# Altium schematic sheet I2C_Multiplexer.SchDoc
size A4; SheetNumber: 14; SheetTotal: 15
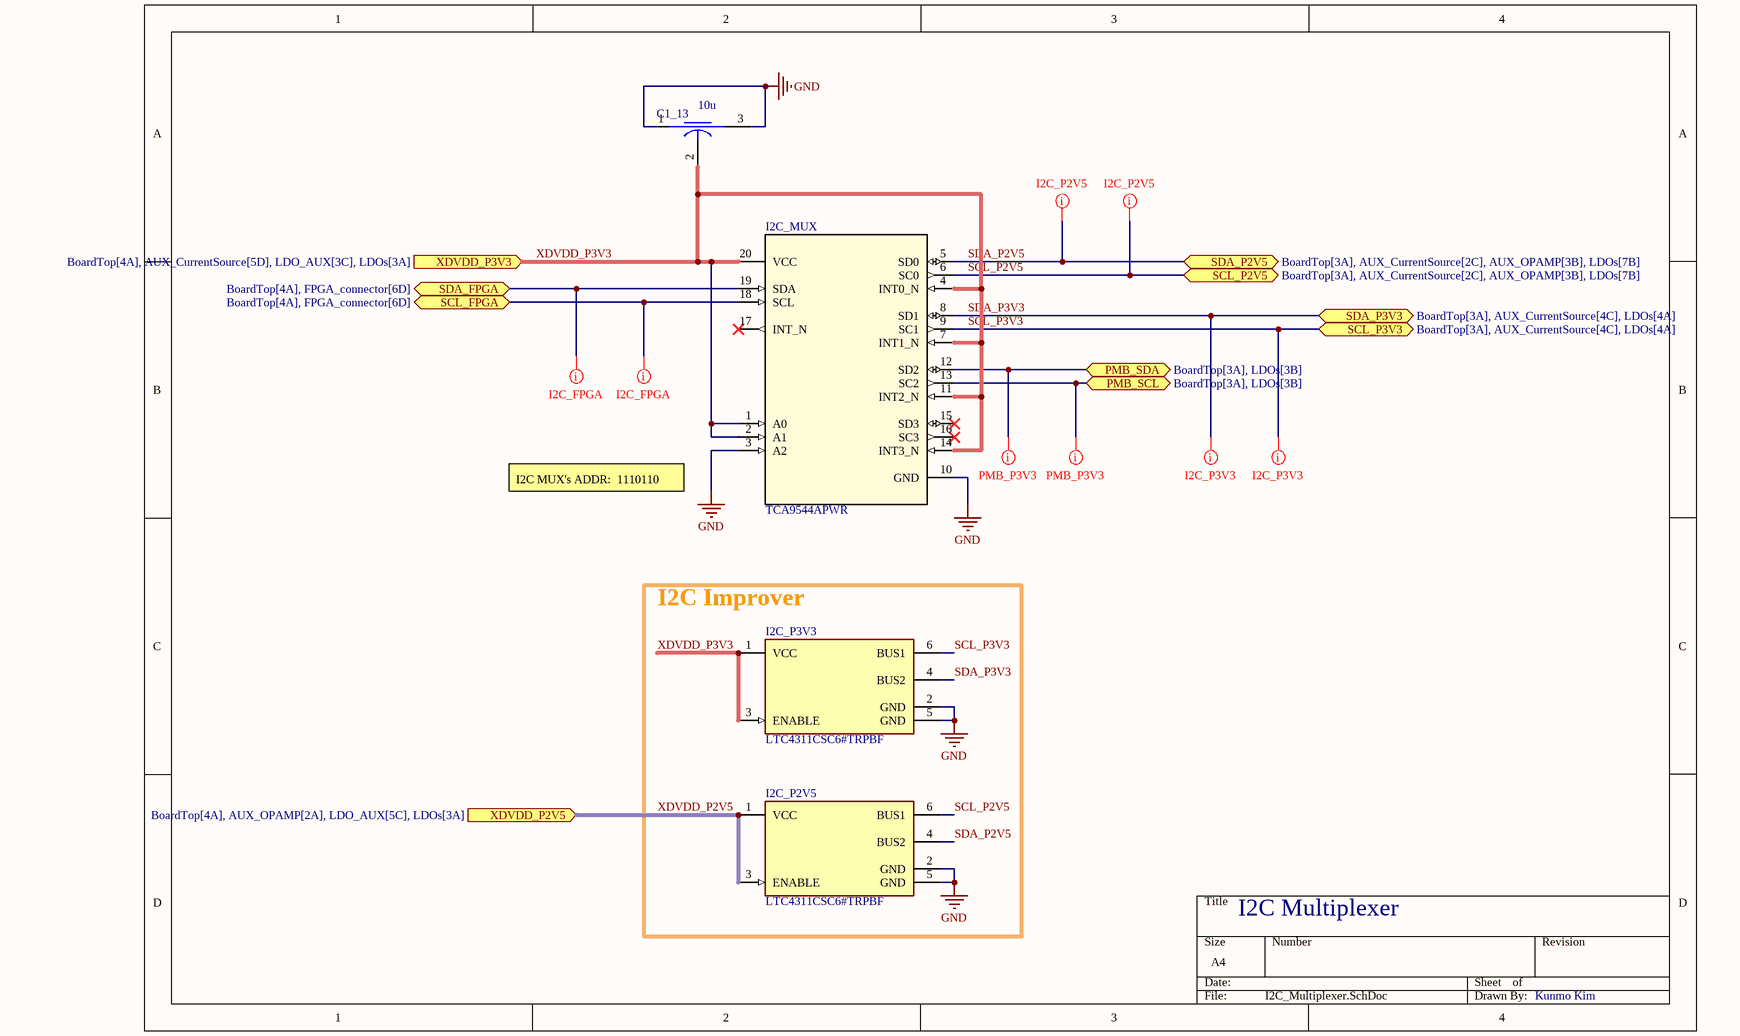
[diagram p0: I2C_Multiplexer.SchDoc]

## Parts
C1_13  10u  [FP-NFM15-0_2-MFG]
I2C_MUX  TCA9544APWR  [PW0020A_L]
I2C_P2V5  LTC4311CSC6#TRPBF  [FP-SC6-6-05-08-1638-IPC_B]
I2C_P3V3  LTC4311CSC6#TRPBF  [FP-SC6-6-05-08-1638-IPC_B]

## Blocks framed on the sheet
I2C Improver: I2C_P2V5 I2C_P3V3

## Ports
PMB_SCL (bidir, see BoardTop[3A], LDOs[3B]), PMB_SDA (bidir, see BoardTop[3A], LDOs[3B]), SCL_FPGA (bidir, see BoardTop[4A], FPGA_connector[6D]), SCL_P2V5 (bidir, see BoardTop[3A], AUX_CurrentSource[2C], AUX_OPAMP[3B], LDOs[7B]), SCL_P3V3 (bidir, see BoardTop[3A], AUX_CurrentSource[4C], LDOs[4A]), SDA_FPGA (bidir, see BoardTop[4A], FPGA_connector[6D]), SDA_P2V5 (bidir, see BoardTop[3A], AUX_CurrentSource[2C], AUX_OPAMP[3B], LDOs[7B]), SDA_P3V3 (bidir, see BoardTop[3A], AUX_CurrentSource[4C], LDOs[4A]), XDVDD_P2V5 (in, see BoardTop[4A], AUX_OPAMP[2A], LDO_AUX[5C], LDOs[3A]), XDVDD_P3V3 (in, see BoardTop[4A], AUX_CurrentSource[5D], LDO_AUX[3C], LDOs[3A])

## Nets
GND: C1_13.1(Input) C1_13.3(Output) I2C_MUX.3(A2) I2C_MUX.10(GND) I2C_P2V5.2(GND) I2C_P2V5.5(GND) I2C_P3V3.2(GND) I2C_P3V3.5(GND)
PMB_SCL: I2C_MUX.13(SC2) ; port PMB_SCL
PMB_SDA: I2C_MUX.12(SD2) ; port PMB_SDA
SCL_FPGA: I2C_MUX.18(SCL) ; port SCL_FPGA
SCL_P2V5: I2C_MUX.6(SC0) I2C_P2V5.6(BUS1) ; port SCL_P2V5
SCL_P3V3: I2C_MUX.9(SC1) I2C_P3V3.6(BUS1) ; port SCL_P3V3
SDA_FPGA: I2C_MUX.19(SDA) ; port SDA_FPGA
SDA_P2V5: I2C_MUX.5(SD0) I2C_P2V5.4(BUS2) ; port SDA_P2V5
SDA_P3V3: I2C_MUX.8(SD1) I2C_P3V3.4(BUS2) ; port SDA_P3V3
XDVDD_P2V5: I2C_P2V5.1(VCC) I2C_P2V5.3(ENABLE) ; port XDVDD_P2V5
XDVDD_P3V3: C1_13.2(GND) I2C_MUX.1(A0) I2C_MUX.2(A1) I2C_MUX.4(INT0_N) I2C_MUX.7(INT1_N) I2C_MUX.11(INT2_N) I2C_MUX.14(INT3_N) I2C_MUX.20(VCC) I2C_P3V3.1(VCC) I2C_P3V3.3(ENABLE) ; port XDVDD_P3V3

Not connected (* = marked no-connect by the designer): I2C_MUX 15(SD3)* 16(SC3)* 17(INT_N)*

## Layout directives
net class I2C_P2V5: SCL_P2V5, SDA_P2V5
net class I2C_P3V3: SCL_P3V3, SDA_P3V3
net class PMB_P3V3: PMB_SCL, PMB_SDA
net class I2C_FPGA: SCL_FPGA, SDA_FPGA

## Notes on the sheet
- I2C MUX's ADDR:  1110110
- I2C Multiplexer
- Kunmo Kim

## Library data of the parts
C1_13 = CMP-06053-000058-1: CAP FEEDTHRU
I2C_MUX = TCA9544APWR: No Description Available; Mfr_Name: Texas Instruments; CompType: IC; TYPE: TYPE; RefDes: RefDes; SymbolVerison: 2015-05-04; PartNumber: TCA9544APWR; PackageReference: PW0020A; MountType: SMT; RoHS: Y; Manufacturer: Texas Instruments
I2C_P2V5 I2C_P3V3 = CMP-09093-000026-1: IC POWER MANAGEMENT; Operating Supply Current: 300uA; Case/Package: SC; Min Operating Temperature: 0°C; Max Operating Temperature: 70°C; RoHS Compliant: Yes; Series: -; Number of Pins: 70; Package Quantity: 2500; Radiation Hardening: No; Mount: Surface Mount; Packaging: Tape and Reel